# Altium schematic sheet St3025_Servo_Schematic.SchDoc
size A4; DocumentNumber: 3; SheetNumber: 3; SheetTotal: 5
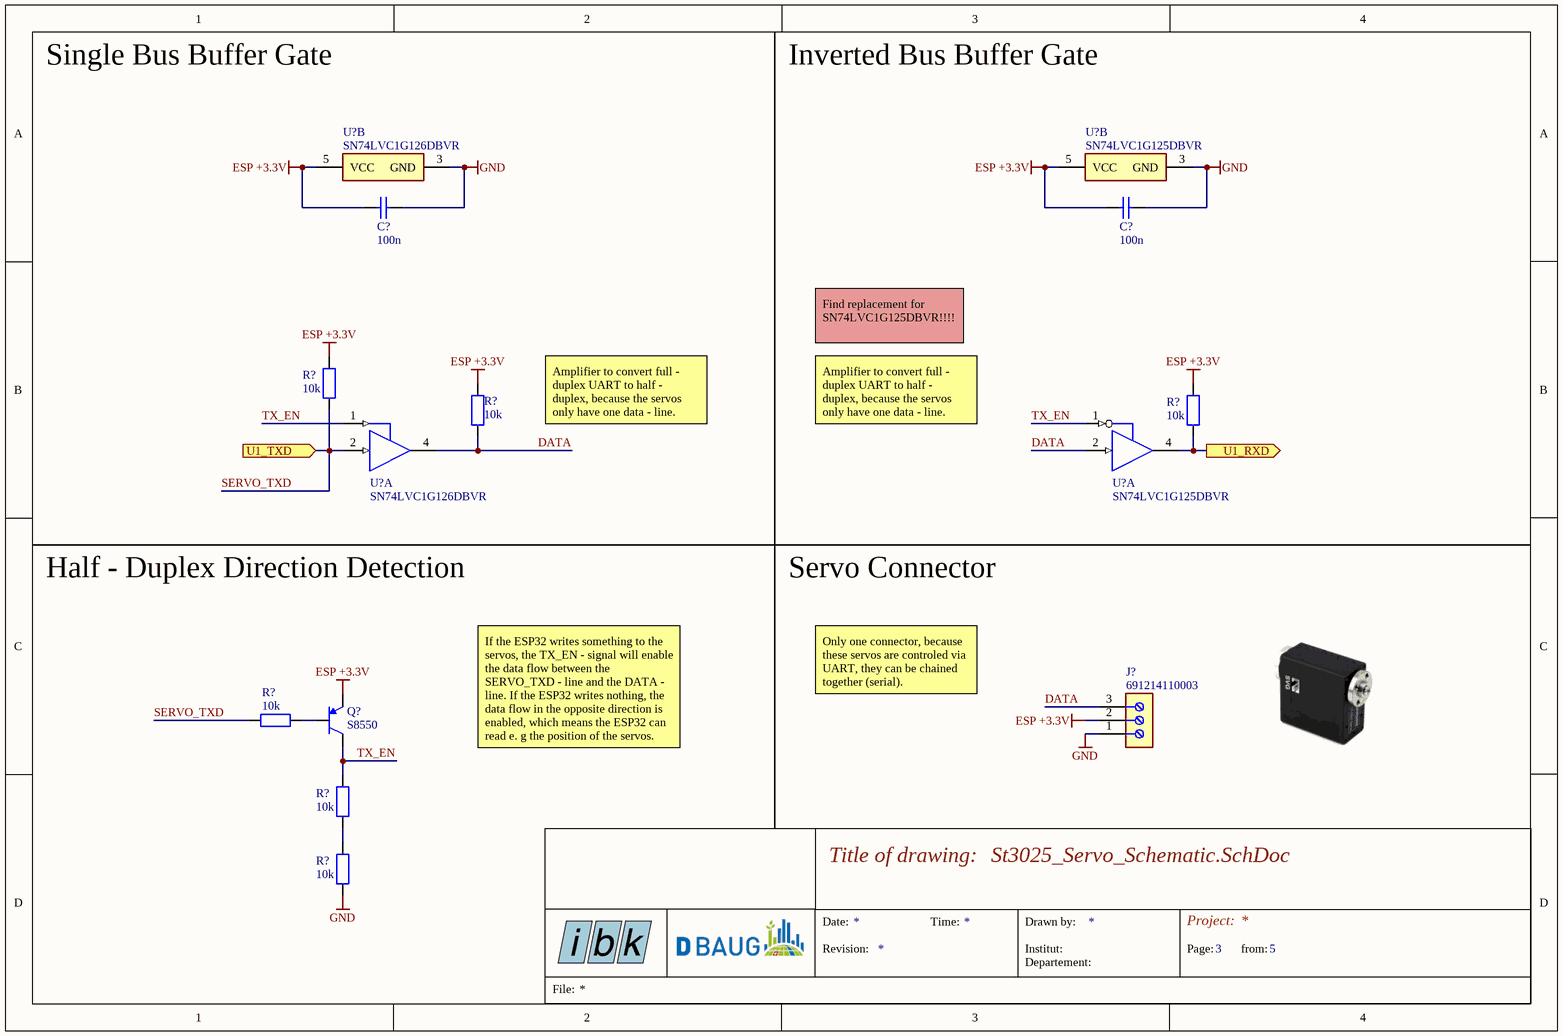
[diagram p0: St3025_Servo_Schematic.SchDoc]

## Parts
(Parts that share a designator on the sheet are numbered #1, #2 ... from top to bottom, then left to right.)
C?#1  100n  [0603_CAPACITOR]
C?#2  100n  [0603_CAPACITOR]
J?  691214110003  [Screw_Connector]
Q?  S8550  [PNP_Bipolar_Transistor]
R?#1  10k  [0603_Resistor]
R?#2  10k  [0603_Resistor]
R?#3  10k  [0603_Resistor]
R?#4  10k  [0603_Resistor]
R?#5  10k  [0603_Resistor]
R?#6  10k  [0603_Resistor]
U?#1  SN74LVC1G126DBVR  [DBV0005A_L_Single_Bus_Buffer_Gate]  (part B of 2)
U?#2  SN74LVC1G125DBVR  [DBV0005A_L_Single_Bus_Buffer_Gate]  (part B of 2)
U?#3  SN74LVC1G126DBVR  [DBV0005A_L_Single_Bus_Buffer_Gate]  (part A of 2)
U?#4  SN74LVC1G125DBVR  [DBV0005A_L_Single_Bus_Buffer_Gate]  (part A of 2)

## Ports
U1_RXD (out), U1_TXD (in)

## Nets
ESP +3.3V: C?#1.2 C?#2.2 J?.2 Q?.2(E) R?#1.2 R?#2.2 R?#3.2 U?#1.5(VCC) U?#2.5(VCC)
GND: C?#1.1 C?#2.1 J?.1 R?#6.1 U?#1.3(GND) U?#2.3(GND)
DATA: J?.3 R?#2.1 U?#3.4(Y) U?#4.2(A)
SERVO_TXD: R?#1.1 R?#4.2 U?#3.2(A) ; port U1_TXD
TX_EN: Q?.3(C) R?#5.2 U?#3.1(OE) U?#4.1(OE)
U1_RXD: R?#3.1 U?#4.4(Y) ; port U1_RXD
NetQ?_1: Q?.1(B) R?#4.1
NetR?#5_1: R?#5.1 R?#6.2

## Notes on the sheet
- Single Bus Buffer Gate
- Inverted Bus Buffer Gate
- Find replacement for SN74LVC1G125DBVR!!!!
- Amplifier to convert full - duplex UART to half - duplex, because the servos only have one data - line.
- Half - Duplex Direction Detection
- Servo Connector
- Only one connector, because these servos are controled via UART, they can be chained together (serial).
- If the ESP32 writes something to the servos, the TX_EN - signal will enable the data flow between the SERVO_TXD - line and the DATA - line. If the ESP32 writes nothing, the data flow in the opposite direction is enabled, which means the ESP32 can read e. g the position of the servos.
- Date:
- Title of drawing:
- Time:
- Drawn by:
- Project:
- Revision:
- Institut:
- Departement:
- Page:
- from:
- File:

## Library data of the parts
C?#1 C?#2 = Capacitor: 0603
J? = Screw_Connector: 691214110003 Wurth Elektronik
Q? = PNP_Bipolar_Transistor: Bipolar (BJT) Transistor PNP 25 V 500 mA 150MHz 300 mW Surface Mount SOT-23.
R?#1-R?#6 = Resistor: 0603
U?#1 U?#3 = Single_Bus_Buffer_Gate: Single Bus Buffer Gate With 3-State Outputs, DBV0005A, LARGE T&R.; ComponentLink1Description: Supplier; ComponentLink1URL: https://www.digikey.com/en/products/detail/texas-instruments/SN74LVC1G126DBVR/385722
U?#2 U?#4 = Single_Bus_Buffer_Gate_Inverted: Single Bus Buffer Gate With 3-State Outputs, DBV0005A, LARGE T&R.; ComponentLink1Description: Supplier; ComponentLink1URL: *